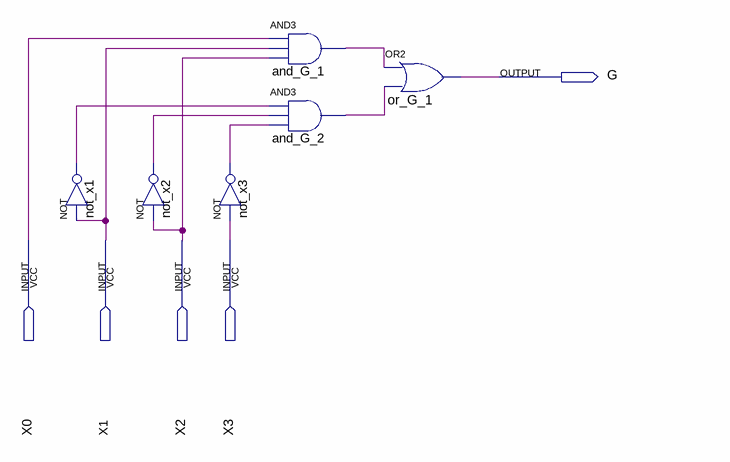
[diagram p0: schematic sheet]
// Quartus schematic dec_segmento_G.bdf as structural Verilog: 6 symbols, 5 pins
module dec_segmento_G (
  input  X0,
  input  X1,
  input  X2,
  input  X3,
  output G
);

  wire and_G_1_out, and_G_2_out, not_x1_out, not_x2_out, not_x3_out;

  not not_x1 (not_x1_out, X1);
  not not_x2 (not_x2_out, X2);
  not not_x3 (not_x3_out, X3);
  and and_G_1 (and_G_1_out, X0, X1, X2);
  and and_G_2 (and_G_2_out, not_x1_out, not_x2_out, not_x3_out);
  or or_G_1 (G, and_G_1_out, and_G_2_out);
endmodule
